# EAGLE schematic Mini LED Module (EAGLE 6.3)
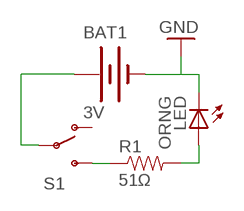
[diagram p0: schematic, sheet 1]

## Parts
BAT1  3V  BATTERY20SMD  [BATTCON_20MM]
LED  ORNG  LED5MM-KIT  [LED5MM-KIT]
R1  51Ω  RESISTOR0603-RES  [0603-RES]
S1  SWITCH-SPDTKIT  [SWITCH-SPDT_KIT]

## Nets
GND: BAT1.2(-) LED.K(C)
N$1: R1.1 S1.3(S)
N$2: LED.A R1.2
N$3: BAT1.1(+) S1.2(P)
Unconnected: S1.1(O)

## Library data of the parts
BAT1 = SparkFun-Electromechanical:BATTERY: Battery Holders Various common sizes : AA, AAA, 20mm coin cell and 12mm coin cell. 20MM_4LEGS, BATT-10373
LED = SparkFun-LED:LED: LEDs Standard schematic elements and footprints for 5mm, 3mm, 1206, and 0603 sized LEDs. 5mm - Spark Fun Electronics SKU : COM-00529 (and others)
R1 = SparkFun-Resistors:RESISTOR: Resistor Basic schematic elements and footprints for 0603, 1206, and PTH resistors.
S1 = SparkFun-Electromechanical:SWITCH-SPDT: SPDT Switch Simple slide switch, Spark Fun Electronics SKU : COM-00102 DPDT SMT slide switch, AYZ0202, SWCH-08179